# Altium schematic sheet [08] - TK2560_Relay.SchDoc
size A4; SheetNumber: 9; SheetTotal: 15
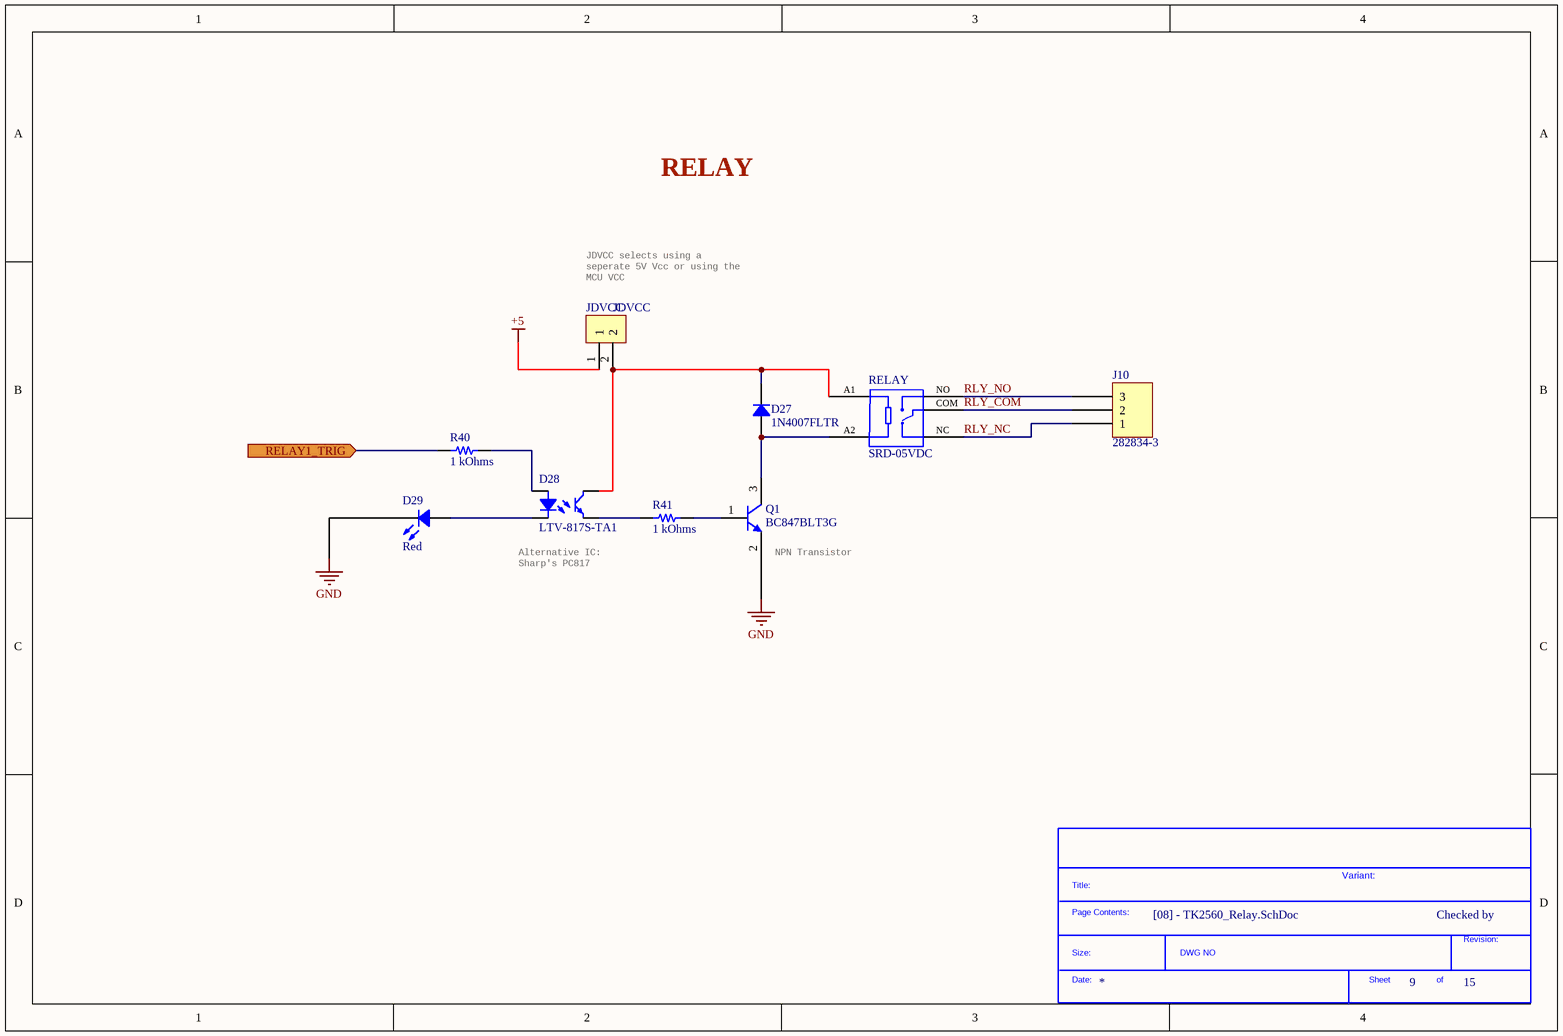
[diagram p0: [08] - TK2560_Relay.SchDoc]

## Parts
*?  SDTitleBlock  (value not drawn)  (graphical)
D27  1N4007FLTR  [SOD123F]
D28  LTV-817S-TA1  [LITEON LTV-817]
D29  Red  [LED 1206_3216 RED]
J10  282834-3  [TE 282834-3]
JDVCC  JDVCC  [HDR_1x2]
Q1  BC847BLT3G  [ON SEMI SOT-23-3]
R40  1 kOhms  [RES 0805_2012]
R41  1 kOhms  [RES 0805_2012]
RELAY  SRD-05VDC  [SRD-05VDC]

## Ports
RELAY1_TRIG (in)

## Nets
+5: JDVCC.1
GND: D29.2 Q1.2(E)
RELAY1_TRIG: R40.2 ; port RELAY1_TRIG
RLY_COM: J10.2 RELAY.COM
RLY_NC: J10.1 RELAY.NC
RLY_NO: J10.3 RELAY.NO
NetD27_1: D27.1 Q1.3(C) RELAY.A2
NetD27_2: D27.2 D28.4 JDVCC.2 RELAY.A1
NetD28_1: D28.1 R40.1
NetD28_2: D28.2 D29.1
NetD28_3: D28.3 R41.2
NetQ1_1: Q1.1(B) R41.1

## Notes on the sheet
- RELAY
- JDVCC selects using a seperate 5V Vcc or using the MCU VCC
- (near D28) Alternative IC: Sharp's PC817
- (near Q1) NPN Transistor
- Variant:
- Checked by
- (in symbol SDTitleBlock) Title:; Page Contents:; Revision:; Size:; DWG NO; Date:; Sheet; of

## Library data of the parts
D27 = 1N4007FLTR: STANDARD RECTIFIER 1000V SOD-123; Manufacturer: SMC Diode Solutions; Capacitance @ Vr, F: 15pF @ 4V, 1MHz; Current - Average Rectified (Io): 1A; Current - Reverse Leakage @ Vr: 5µA @ 1000V; Speed: Standard Recovery >500ns, > 200mA (Io); Voltage - Forward (Vf) (Max) @ If: 1.1V @ 1A; Part Number: 1N4007FLTR; ComponentLink1Description: Datasheet; ComponentLink1URL: http://www.smc-diodes.com/propdf/1N4001FL-1N4007FL%20N1646%20REV.A.pdf; ComponentLink2Description: DigiKey Link; ComponentLink2URL: http://digikey.com/product-detail/en/smc-diode-solutions/1N4007FLTR/1655-1N4007FLCT-ND/11657827; Diode Type: Standard; LastUpdated: 30/08/2020 20:59:55; Lifecycle Status: Active; Minimum Order: 1; Mounting Type: Surface Mount; Package / Case: SOD-123F; Packaging: TapeAndReel; PartId: 3314; Price: 0.01; Supplier 1: DigiKey; Supplier Part Number 1: 1655-1N4007FLCT-ND; Supplier Device Package: SOD-123FL; Voltage - DC Reverse (Vr) (Max): 1000V
D28 = LTV-817S-TA1: OPTOISOLATR 5KV TRANSISTOR 4-SMD; Manufacturer: Lite-On Inc.; Current - DC Forward (If) (Max): 50mA; Current Transfer Ratio (Max): 600% @ 5mA; Current Transfer Ratio (Min): 50% @ 5mA; Input Type: DC; Number of Channels: 1; Rise / Fall Time (Typ): 4µs, 3µs; Vce Saturation (Max): 200mV; Voltage - Forward (Vf) (Typ): 1.2V; Voltage - Isolation: 5000Vrms; Voltage - Output (Max): 35V; Part Number: LTV-817S-TA1; ComponentLink1Description: Datasheet; ComponentLink1URL: http://optoelectronics.liteon.com/upload/download/DS-70-96-0016/LTV-8X7%20series%20201610%20.pdf; ComponentLink2Description: DigiKey Link; ComponentLink2URL: http://digikey.com/product-detail/en/lite-on-inc/LTV-817S-TA1/160-1893-1-ND/3306757; Current - Output / Channel: 50mA; Device Package: 4-SMD, Gull Wing; LastUpdated: 12/01/2020 21:58:48; Lifecycle Status: Active; Minimum Order: 1; Mounting Type: Surface Mount; Operating Temperature: -30°C ~ 110°C; Output Type: Transistor; Package / Case: 4-SMD, Gull Wing; Packaging: TapeAndReel; Part Status: Active; Price: 0.12; Series: -; Supplier 1: DigiKey; Supplier Part Number 1: 160-1893-1-ND; Supplier Device Package: 4-SMD
D29 = XZMDK55W-A2RT: LED RED CLEAR 2SMD; Manufacturer: SunLED; Configuration: Standard; Current - Test: 20mA; Lens Color: Colorless; Lens Size: 1.10mm Dia; Lens Style: Round with Flat Top; Millicandela Rating: 228mcd; Viewing Angle: 70°; Voltage - Forward (Vf) (Typ): 1.95V; Wavelength - Dominant: 630nm; Wavelength - Peak: 645nm; Part Number: XZMDK55W-A2RT; Color: Red; ComponentLink1Description: Datasheet; ComponentLink1URL: https://www.sunledusa.com/products/spec/XZMDK55W-A2RT.pdf; ComponentLink2Description: DigiKey Link; ComponentLink2URL: http://digikey.com/product-detail/en/sunled/XZMDK55W-A2RT/1497-1289-1-ND/5775269; Device Package: 1206 (3216 Metric); Height (Max): 1.20mm; LastUpdated: 02/09/2020 01:21:09; Lens Transparency: Clear; Lifecycle Status: Active; Minimum Order: 1; Mounting Type: Surface Mount; Package / Case: 1206 (3216 Metric); Packaging: TapeAndReel; PartId: 183; Part Status: Active; Price: 0.08; Series: -; Size / Dimension: 3.20mm L x 1.60mm W; Supplier 1: DigiKey; Supplier Part Number 1: 1497-1289-1-ND; Supplier Device Package: 2-SMD; Value: Red
J10 = 282834-3: TERM BLK 3P SIDE ENT 2.54MM PCB; Manufacturer: TE Connectivity AMP Connectors; Current: 10A; Mating Orientation: Horizontal with Board; Number of Levels: 1; Pitch: 0.100" (2.54mm); Positions Per Level: 3; Voltage: 150V; Wire Gauge: 16-30 AWG; Wire Termination: Screw - Rising Cage Clamp; Part Number: 282834-3; Color: Green; ComponentLink1Description: Datasheet; ComponentLink1URL: https://www.te.com/commerce/DocumentDelivery/DDEController?Action=srchrtrv&DocNm=282834&DocType=Customer+Drawing&DocLang=English; ComponentLink2Description: DigiKey Link; ComponentLink2URL: http://digikey.com/product-detail/en/te-connectivity-amp-connectors/282834-3/A98334-ND/1153264; LastUpdated: 15/01/2020 04:15:50; Lifecycle Status: Active; Minimum Order: 1; Mounting Type: Through Hole; Packaging: Bulk; Part Status: Active; Price: 2.01; Series: Buchanan; Supplier 1: DigiKey; Supplier Part Number 1: A98334-ND
JDVCC = HDR_1x2: Pin Header 2.54MM Pitch Str, 1X2PIN, Full G/f, NY6T, 6.1MM*2.5MM*3.0MM / Bag; Manufacturer: Amphenol; Manufacturer Part Number: G800W306018EU; Supplier 1: Mouser; Stock 1: 1088; Pricing 1: 1=0.10000, 10=0.02700, 50=0.02700, 100=0.02600, 1000=0.02200, 10000=0.01900 (USD); RoHS Compliant: Yes; Supplier Part Number 1: 523-G800W306018EU
Q1 = BC847BLT3G: TRANS NPN 45V 0.1A SOT-23; Manufacturer: ON Semiconductor; Current - Collector Cutoff (Max): 15nA (ICBO); Current - Collector (Ic) (Max): 100mA; DC Current Gain (hFE) (Min) @ Ic, Vce: 200 @ 2mA, 5V; Frequency - Transition: 100MHz; Power - Max: 300mW; Vce Saturation (Max) @ Ib, Ic: 600mV @ 5mA, 100mA; Part Number: BC847BLT3G; ComponentLink1Description: Datasheet; ComponentLink1URL: http://www.onsemi.com/pub/Collateral/BC846ALT1-D.PDF; ComponentLink2Description: DigiKey Link; ComponentLink2URL: http://digikey.com/product-detail/en/on-semiconductor/BC847BLT3G/BC847BLT3GOSCT-ND/2704957; LastUpdated: 02/09/2020 01:30:08; Lifecycle Status: Active; Minimum Order: 1; Mounting Type: Surface Mount; Operating Temperature: -55°C ~ 150°C (TJ); Package / Case: TO-236-3, SC-59, SOT-23-3; Packaging: TapeAndReel; PartId: 157; Part Status: Active; Price: 0.02; Series: -; Supplier 1: DigiKey; Supplier Part Number 1: BC847BLT3GOSCT-ND; Supplier Device Package: SOT-23-3 (TO-236); Transistor Type: NPN; Voltage - Collector Emitter Breakdown (Max): 45V
R40 R41 = RNCP0805FTD1K00: RES 1K OHM 1% 1/4W 0805; Manufacturer: Stackpole Electronics Inc; Power (Watts): 0.25W, 1/4W; Temperature Coefficient: ±100ppm/°C; Part Number: RNCP0805FTD1K00; Value: 1 kOhms; ComponentLink1Description: Datasheet; ComponentLink1URL: https://www.seielect.com/catalog/sei-rncp.pdf; ComponentLink2Description: DigiKey Link; ComponentLink2URL: http://digikey.com/product-detail/en/stackpole-electronics-inc/RNCP0805FTD1K00/RNCP0805FTD1K00CT-ND/2240568; Composition: Thin Film; Device Package: 0805 (2012 Metric); Features: Anti-Sulfur, Moisture Resistant; Height - Seated (Max): 0.024" (0.60mm); LastUpdated: 02/09/2020 01:15:23; Lifecycle Status: Active; Minimum Order: 1; Number of Terminations: 2; Operating Temperature: -55°C ~ 155°C; Package / Case: 0805 (2012 Metric); Packaging: TapeAndReel; PartId: 28023; Part Status: Active; Price: 0.01; Resistance: 1 kOhms; Series: RNCP; Size / Dimension: 0.079" L x 0.049" W (2.00mm x 1.25mm); Supplier 1: DigiKey; Supplier Part Number 1: RNCP0805FTD1K00CT-ND; Supplier Device Package: 0805; Tolerance: ±1%
RELAY = SRD-05VDC: TE CONNECTIVITY - 1-1721150-0 - POWER RELAY, SPDT, 277VAC, 10A, TH; Manufacturer: TE Connectivity P&B; Contact Current Rating: 15A; Coil Voltage (DC): 5V; Voltage Rating (AC): 125V; Manufacturer Part Number: 1-1721150-0; RoHS: Yes; Category: Signal Relays; Stock 1: 9261; Pricing 1: 1=1.34000, 10=1.26000, 25=1.12000, 50=1.06400, 100=1.00800, 250=0.89600, 500=0.84000, 1000=0.78400, 5000=0.75600 (USD); Mount: Through Hole; Number of Pins: 5; Weight: 9.5g; Max Operating Temperature: 85°C; Packaging: Rail/Tube; Throw Configuration: SPDT; Termination: PCB; Length: 19mm; Width: 15.5mm; Height: 15.8mm; Depth: 15.5mm; Lead Free: Lead Free; ELV: Compliant; ComponentLink1URL: https://datasheet.ciiva.com/14189/eng-cd-1721150-c-14189465.pdf?src-supplier=Avnet; ComponentLink1Description: https://datasheet.ciiva.com/14189/eng-cd-1721150-c-14189465.pdf?src-supplier=Avnet; ComponentLink2URL: https://datasheet.ciiva.com/48542/eng-cd-1721150-c-48542490.pdf?src-supplier=Onlinecomponents.com; ComponentLink2Description: https://datasheet.ciiva.com/48542/eng-cd-1721150-c-48542490.pdf?src-supplier=Onlinecomponents.com; Supplier 1: Digi-Key; Supplier Part Number 1: PB2032-ND